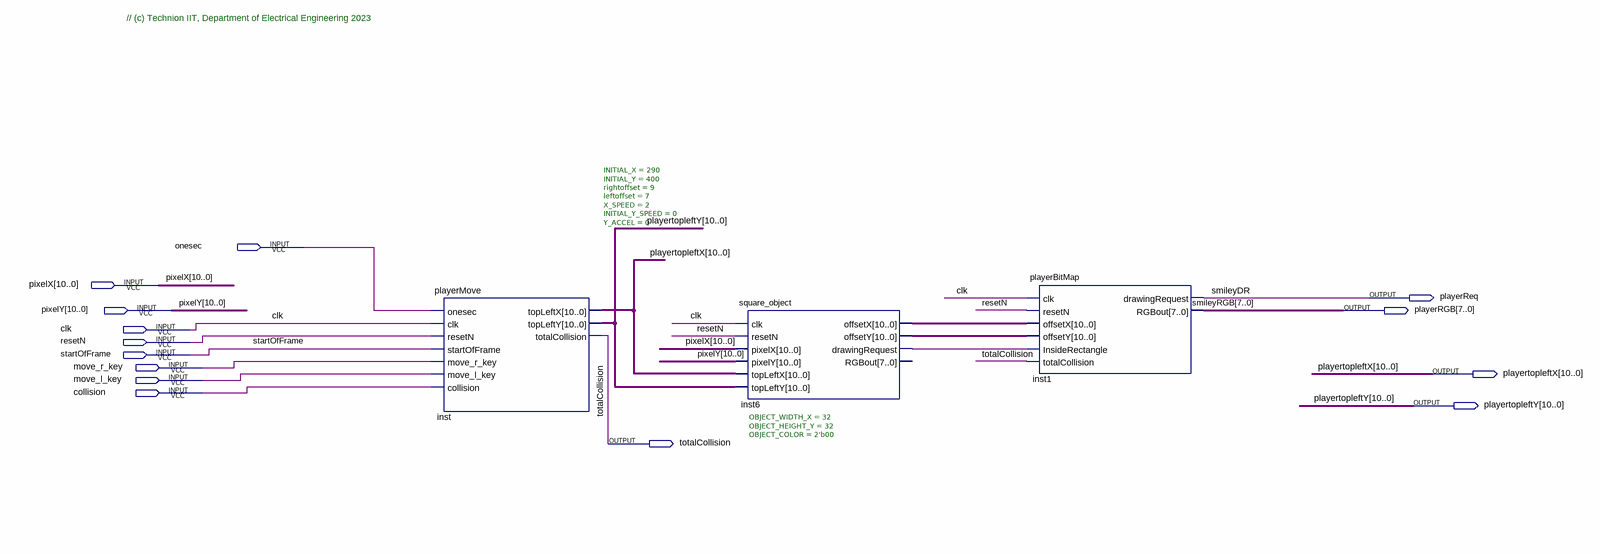
[diagram p0: schematic sheet]
// Quartus schematic playerBlock.bdf as structural Verilog: 3 symbols, 14 pins
module playerBlock (
  input  onesec,
  input  [10:0] pixelX,
  input  [10:0] pixelY,
  input  clk,
  input  resetN,
  input  startOfFrame,
  input  move_r_key,
  input  move_l_key,
  input  collision,
  output playerReq,
  output [7:0] playerRGB,
  output [10:0] playertopleftX,
  output [10:0] playertopleftY,
  output totalCollision
);

  wire inst6_drawingrequest;
  wire [10:0] inst6_offsetx, inst6_offsety;

  playerMove #(.INITIAL_X(290), .INITIAL_Y(400), .rightoffset(9), .leftoffset(7), .X_SPEED(2), .INITIAL_Y_SPEED(0), .Y_ACCEL(0)) inst (
    .onesec(onesec), .clk(clk), .resetN(resetN), .startOfFrame(startOfFrame), .move_r_key(move_r_key),
    .move_l_key(move_l_key), .collision(collision), .topLeftX(playertopleftX), .topLeftY(playertopleftY),
    .totalCollision(totalCollision));
  square_object #(.OBJECT_WIDTH_X(32), .OBJECT_HEIGHT_Y(32), .OBJECT_COLOR(2'b00)) inst6 (
    .clk(clk), .resetN(resetN), .pixelX(pixelX), .pixelY(pixelY), .topLeftX(playertopleftX),
    .topLeftY(playertopleftY), .offsetX(inst6_offsetx), .offsetY(inst6_offsety),
    .drawingRequest(inst6_drawingrequest));  // open: RGBout
  playerBitMap inst1 (
    .clk(clk), .resetN(resetN), .offsetX(inst6_offsetx), .offsetY(inst6_offsety),
    .InsideRectangle(inst6_drawingrequest), .totalCollision(totalCollision), .drawingRequest(playerReq),
    .RGBout(playerRGB));

  // Other names for the same wires on the sheet: smileyDR = playerReq; smileyRGB[7:0] = playerRGB

  // Notes on the sheet:
  //   // (c) Technion IIT, Department of Electrical Engineering 2023
endmodule
